# Altium schematic sheet 0251_GPU VREG_ SVID.SchDoc
size 848 x 558 mm
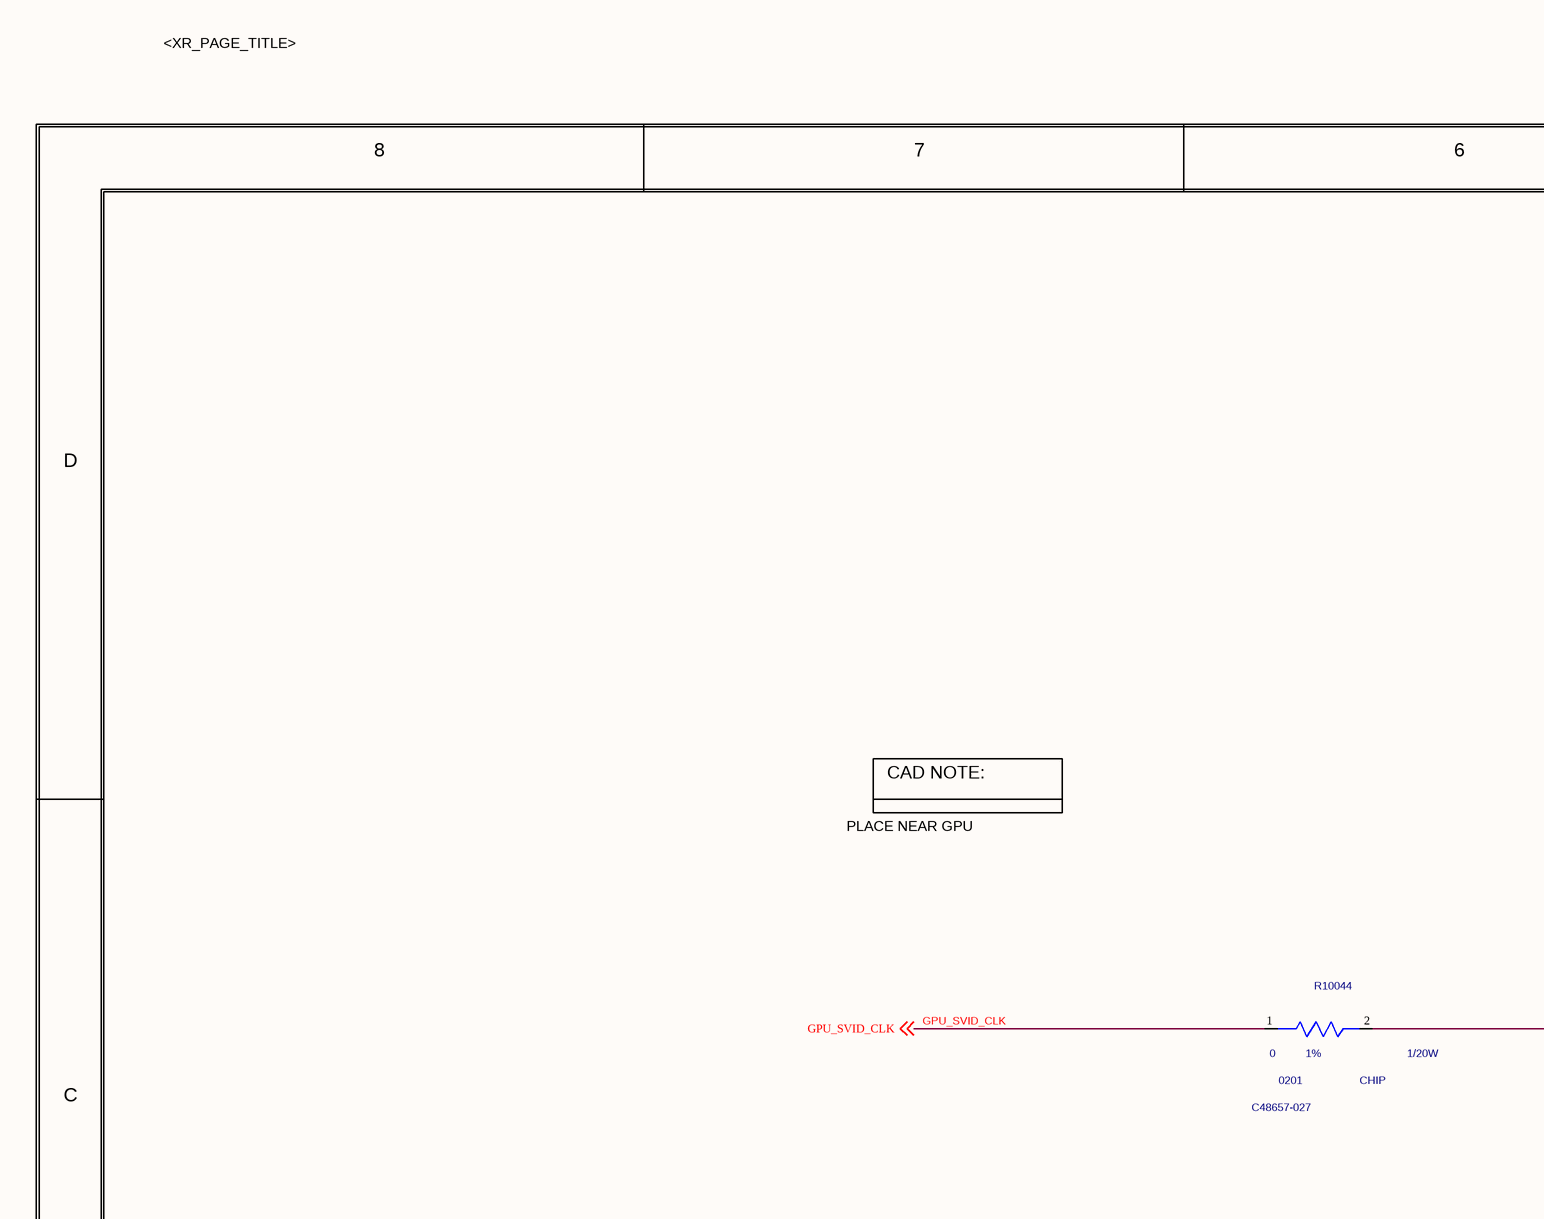
[diagram p0: 0251_GPU VREG_ SVID.SchDoc, top left]
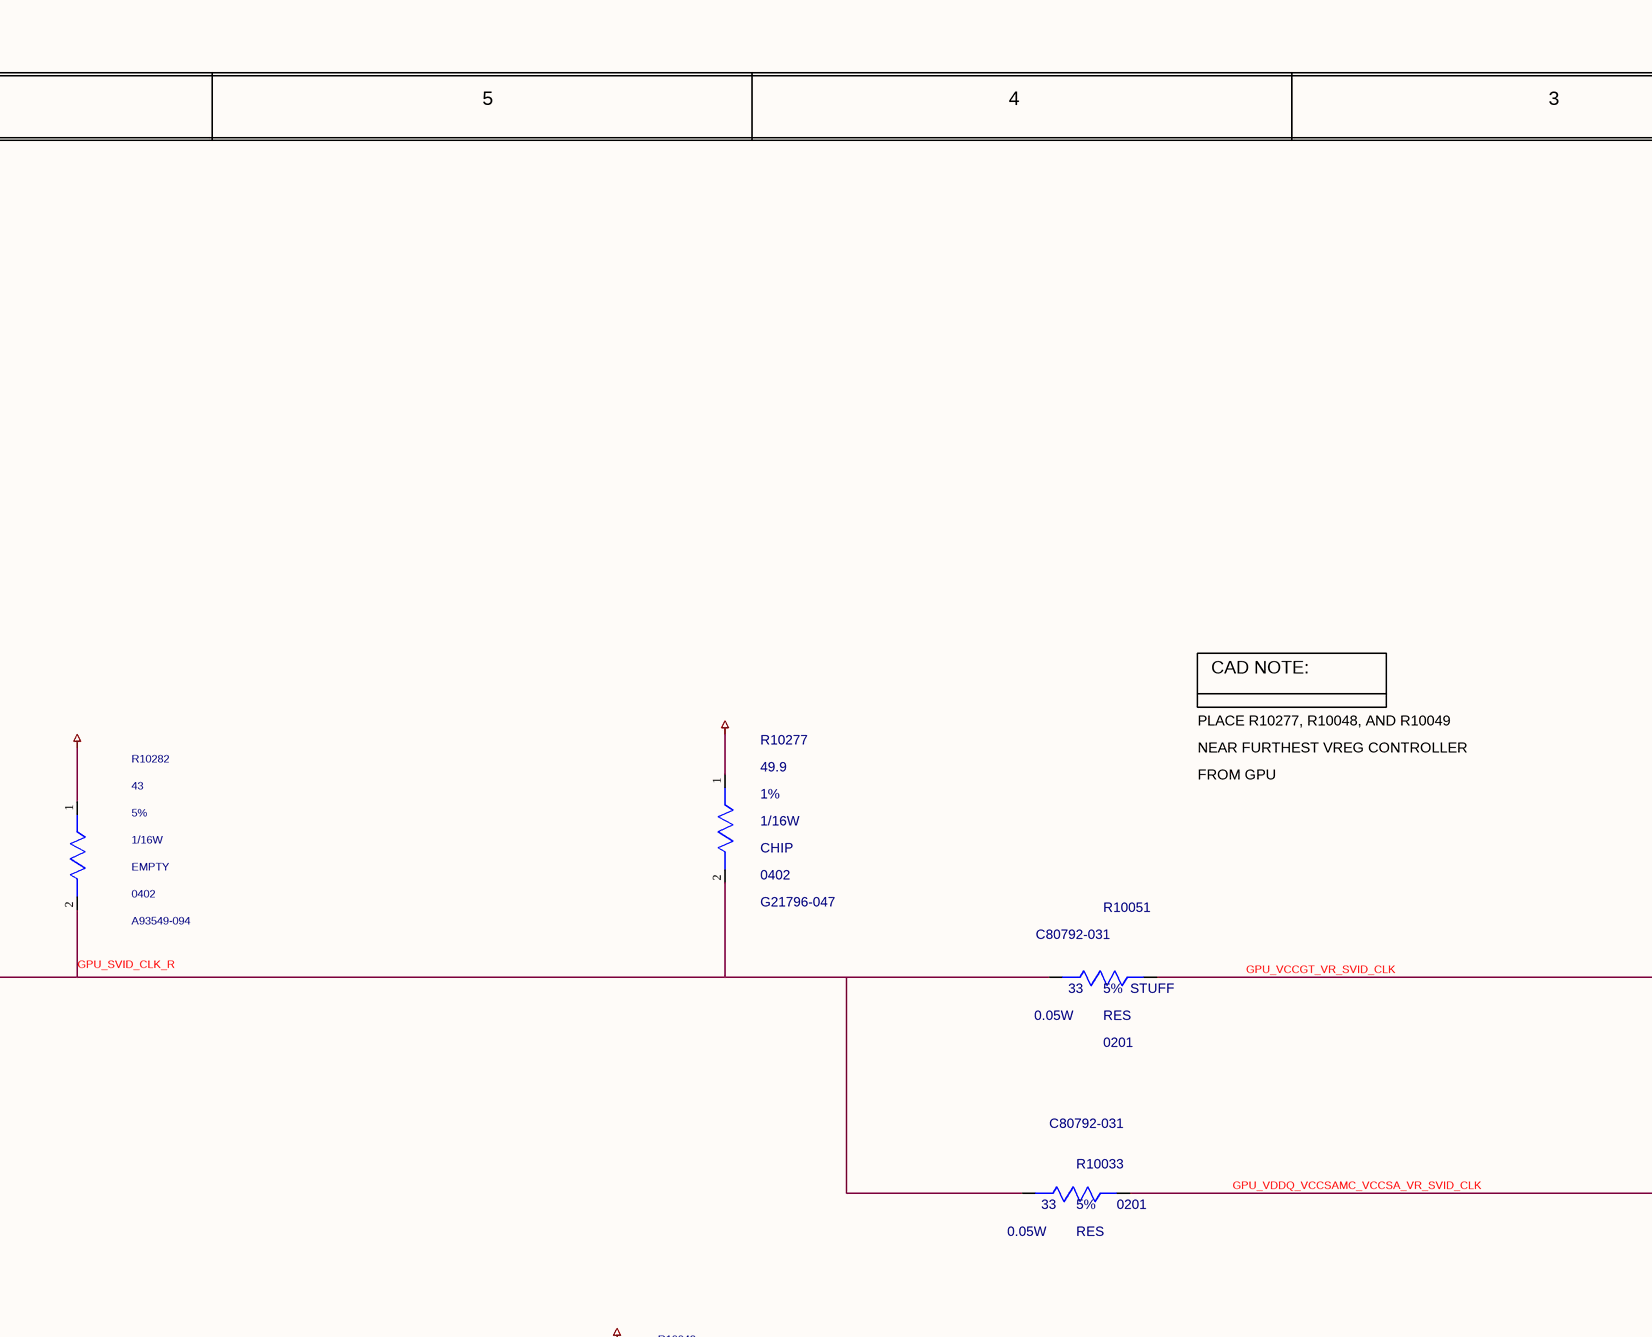
[diagram p1: 0251_GPU VREG_ SVID.SchDoc, top middle]
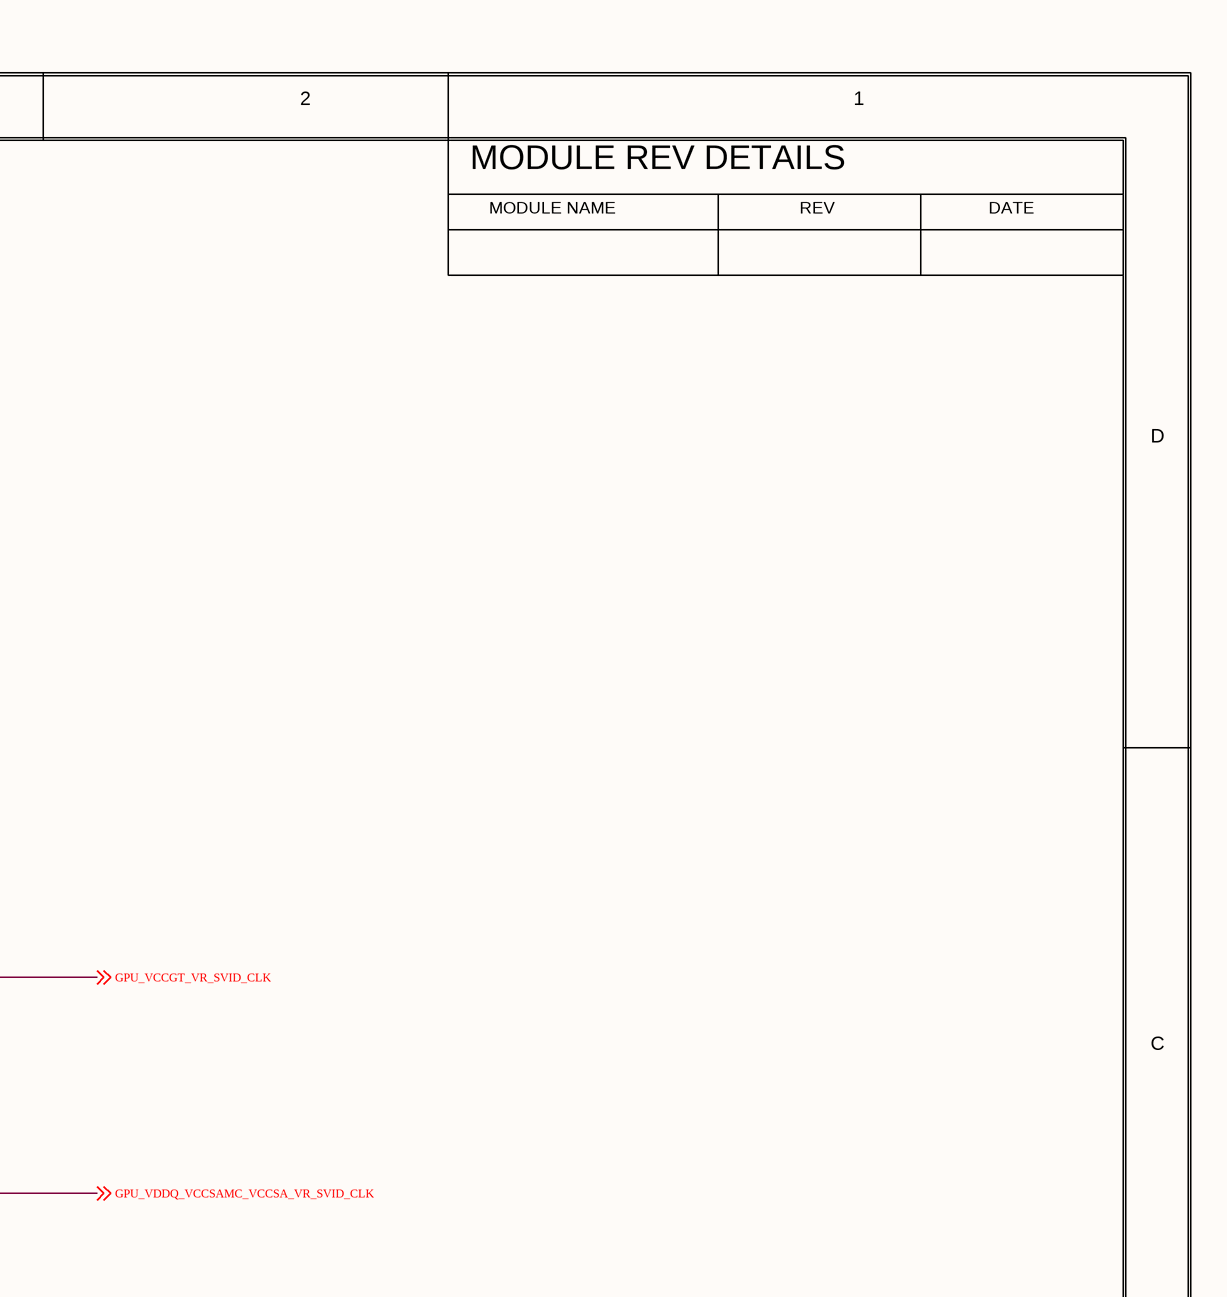
[diagram p2: 0251_GPU VREG_ SVID.SchDoc, top right]
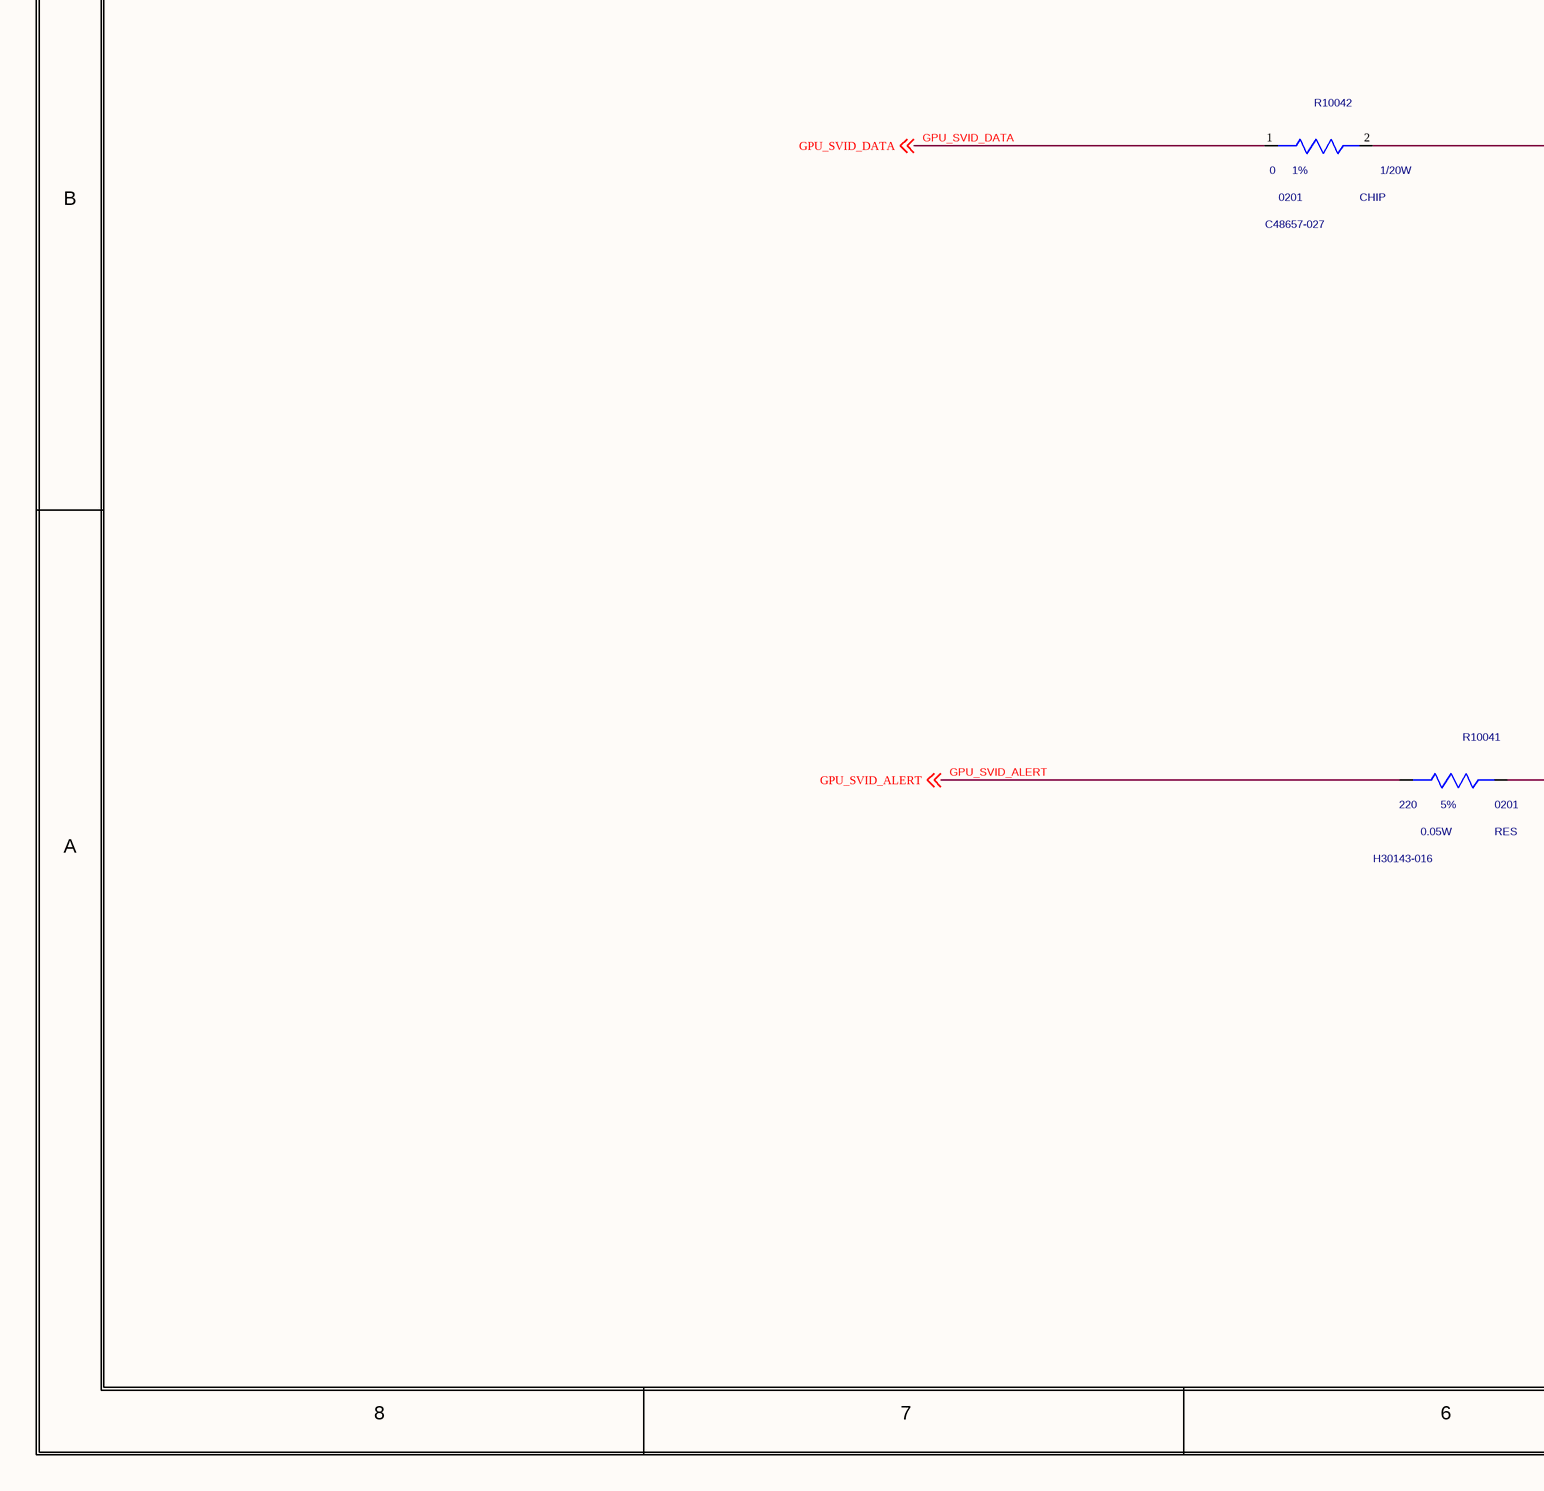
[diagram p3: 0251_GPU VREG_ SVID.SchDoc, bottom left]
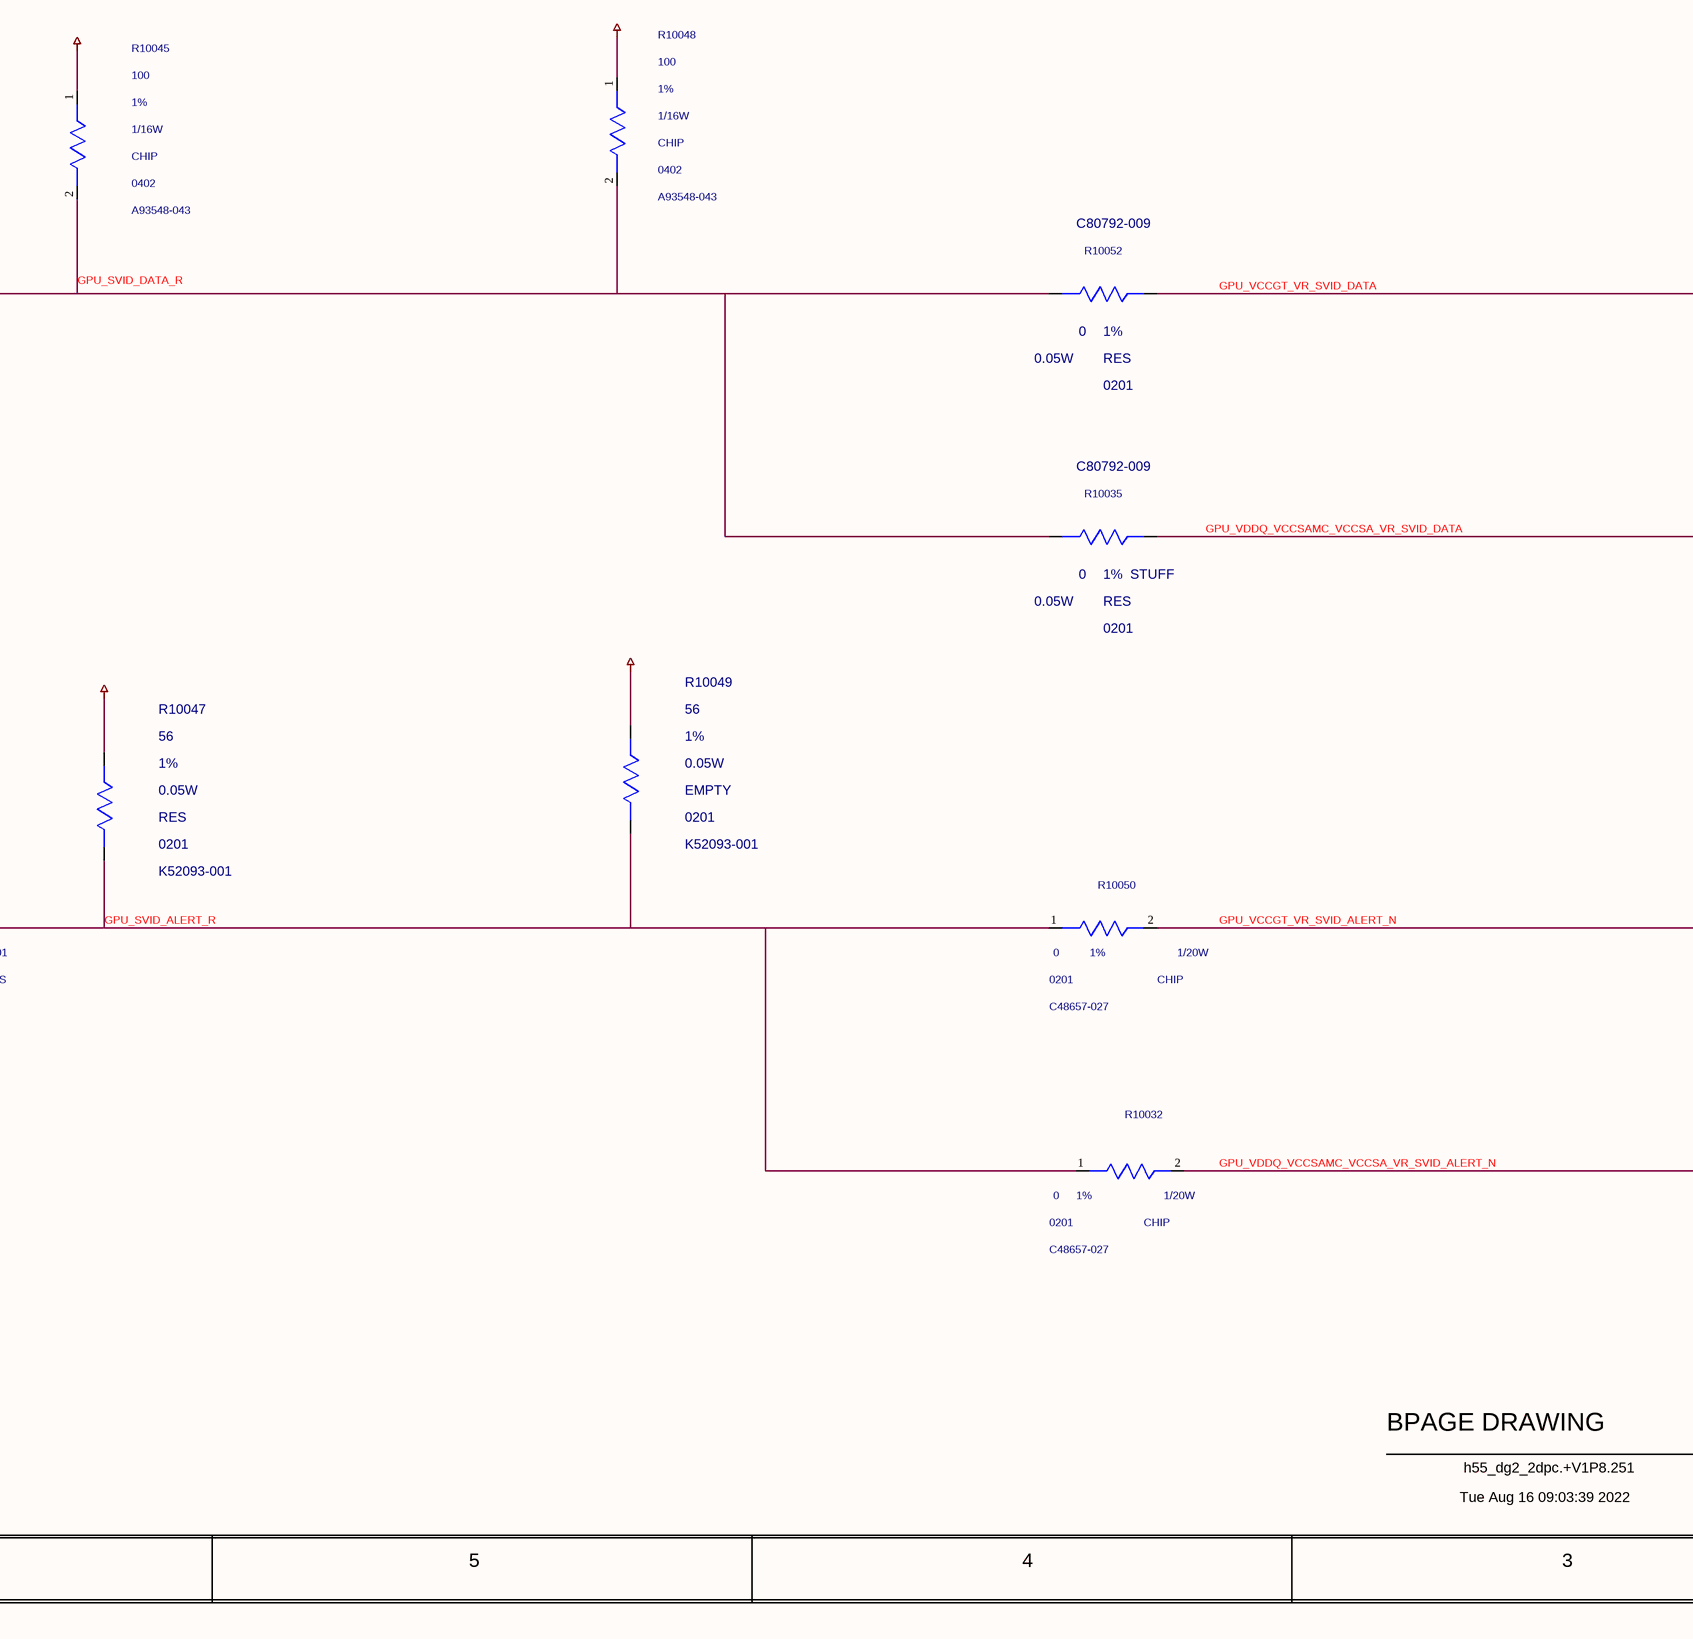
[diagram p4: 0251_GPU VREG_ SVID.SchDoc, bottom middle]
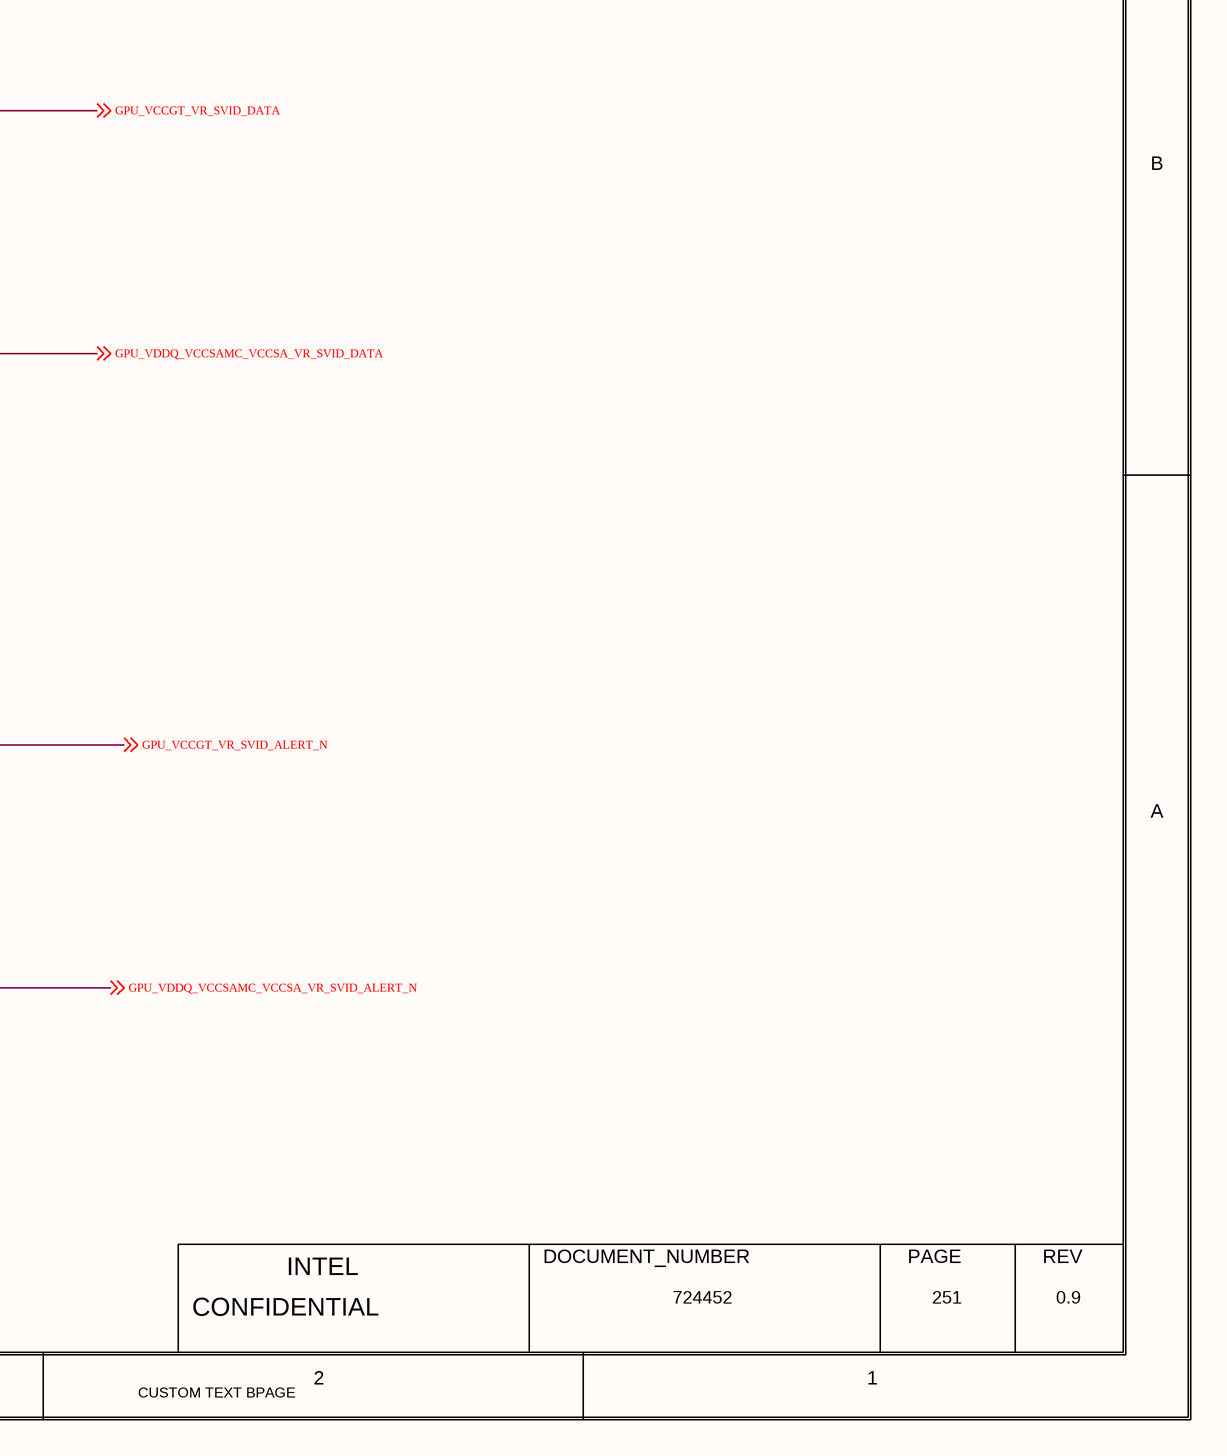
[diagram p5: 0251_GPU VREG_ SVID.SchDoc, bottom right]

## Parts
R10032  0  MATERIAL: CHIP  PACK_TYPE: 0201  PART_NUMBER: C48657-027  TOLERANCE: 1%  WATTAGE: 1/20W  [SMR0201IA]
R10033  33  MATERIAL: RES  PACK_TYPE: 0201  PART_NUMBER: C80792-031  TOLERANCE: 5%  WATTAGE: 0.05W  [TK0_SM0201_630X330_MC]
R10035  0  BOM_USE: STUFF  MATERIAL: RES  PACK_TYPE: 0201  PART_NUMBER: C80792-009  TOLERANCE: 1%  WATTAGE: 0.05W  [TK0_SM0201_630X330_MC]
R10041  220  MATERIAL: RES  PACK_TYPE: 0201  PART_NUMBER: H30143-016  TOLERANCE: 5%  WATTAGE: 0.05W  [CTK0_SM0201_630X330_MA]
R10042  0  MATERIAL: CHIP  PACK_TYPE: 0201  PART_NUMBER: C48657-027  TOLERANCE: 1%  WATTAGE: 1/20W  [SMR0201IA]
R10044  0  MATERIAL: CHIP  PACK_TYPE: 0201  PART_NUMBER: C48657-027  TOLERANCE: 1%  WATTAGE: 1/20W  [SMR0201IA]
R10045  100  MATERIAL: CHIP  PACK_TYPE: 0402  PART_NUMBER: A93548-043  TOLERANCE: 1%  WATTAGE: 1/16W  [SMR0402IA]
R10047  56  MATERIAL: RES  PACK_TYPE: 0201  PART_NUMBER: K52093-001  TOLERANCE: 1%  WATTAGE: 0.05W  [TK0_SM0201_650X350_MB]
R10048  100  MATERIAL: CHIP  PACK_TYPE: 0402  PART_NUMBER: A93548-043  TOLERANCE: 1%  WATTAGE: 1/16W  [SMR0402IA]
R10049  56  MATERIAL: EMPTY  PACK_TYPE: 0201  PART_NUMBER: K52093-001  TOLERANCE: 1%  WATTAGE: 0.05W  [TK0_SM0201_650X350_MB]
R10050  0  MATERIAL: CHIP  PACK_TYPE: 0201  PART_NUMBER: C48657-027  TOLERANCE: 1%  WATTAGE: 1/20W  [SMR0201IA]
R10051  33  BOM_USE: STUFF  MATERIAL: RES  PACK_TYPE: 0201  PART_NUMBER: C80792-031  TOLERANCE: 5%  WATTAGE: 0.05W  [TK0_SM0201_630X330_MC]
R10052  0  MATERIAL: RES  PACK_TYPE: 0201  PART_NUMBER: C80792-009  TOLERANCE: 1%  WATTAGE: 0.05W  [TK0_SM0201_630X330_MC]
R10277  49.9  MATERIAL: CHIP  PACK_TYPE: 0402  PART_NUMBER: G21796-047  TOLERANCE: 1%  WATTAGE: 1/16W  [SMR0402IA]
R10282  43  MATERIAL: EMPTY  PACK_TYPE: 0402  PART_NUMBER: A93549-094  TOLERANCE: 5%  WATTAGE: 1/16W  [SMR0402IA]

## Nets
+V1P8S_GPU: R10045.1(A) R10047.1(A) R10048.1(A) R10049.1(A) R10277.1(A) R10282.1(A)
GPU_SVID_ALERT: R10041.1(A) ; off-sheet GPU_SVID_ALERT
GPU_SVID_ALERT_R: R10032.1(A) R10041.2(B) R10047.2(B) R10049.2(B) R10050.1(A)
GPU_SVID_CLK: R10044.1(A) ; off-sheet GPU_SVID_CLK
GPU_SVID_CLK_R: R10033.1(A) R10044.2(B) R10051.1(A) R10277.2(B) R10282.2(B)
GPU_SVID_DATA: R10042.1(A) ; off-sheet GPU_SVID_DATA
GPU_SVID_DATA_R: R10035.1(A) R10042.2(B) R10045.2(B) R10048.2(B) R10052.1(A)
GPU_VCCGT_VR_SVID_ALERT_N: R10050.2(B) ; off-sheet GPU_VCCGT_VR_SVID_ALERT_N
GPU_VCCGT_VR_SVID_CLK: R10051.2(B) ; off-sheet GPU_VCCGT_VR_SVID_CLK
GPU_VCCGT_VR_SVID_DATA: R10052.2(B) ; off-sheet GPU_VCCGT_VR_SVID_DATA
GPU_VDDQ_VCCSAMC_VCCSA_VR_SVID_ALERT_N: R10032.2(B) ; off-sheet GPU_VDDQ_VCCSAMC_VCCSA_VR_SVID_ALERT_N
GPU_VDDQ_VCCSAMC_VCCSA_VR_SVID_CLK: R10033.2(B) ; off-sheet GPU_VDDQ_VCCSAMC_VCCSA_VR_SVID_CLK
GPU_VDDQ_VCCSAMC_VCCSA_VR_SVID_DATA: R10035.2(B) ; off-sheet GPU_VDDQ_VCCSAMC_VCCSA_VR_SVID_DATA

## Notes on the sheet
- <XR_PAGE_TITLE>
- 8
- 7
- 6
- 5
- 4
- 3
- 2
- 1
- MODULE REV DETAILS
- MODULE NAME
- REV
- DATE
- D
- CAD NOTE:
- PLACE R10277, R10048, AND R10049
- PLACE NEAR GPU
- NEAR FURTHEST VREG CONTROLLER
- FROM GPU
- C
- B
- A
- BPAGE DRAWING
- INTEL
- DOCUMENT_NUMBER
- PAGE
- Tue Aug 16 09:03:39 2022
- h55_dg2_2dpc.+V1P8.251
- CONFIDENTIAL
- 724452
- 251
- 0.9
- CUSTOM TEXT BPAGE

## Library data of the parts
R10032 = RES#1: CHIPS_PART_NAME: RES; CDS_PHYS_PART_NAME: RES_0201-C48657-027,CHIP,0,1%,1/20W,LPDB,GENERIC; OriginalSymbolOrigin: (-75,25); XY: (-3400,1225); VER: 1; PHYS_PAGE: 251; LOCATION: R10032; DRAWING: @RVP1_ADL_SB_ADP_S_DDR5_SODIMM_2DPC_LIB.H55_DG2_2DPC(SCH_1):PAGE363; CDS_LIB: discrete; PCB Footprint: SMR0201IA; ROT: 0; CDS_PART_NAME: RES_0201-C48657-027,CHIP,0,1%,1/20W,LPDB,GENERIC; CDS_LOCATION: R10032
R10033 = RES_2#1: CHIPS_PART_NAME: RES_2; CDS_PHYS_PART_NAME: RES_2_0201-C80792-031,RES,33,5%,0.05W,TK0,GENERIC; BOM_USE: STUFF; CDS_LMAN_SYM_OUTLINE: -50,50,50,-50; FP_TECH: TK0; IP: GENERIC; ROOM: NONE; OriginalSymbolOrigin: (-75,25); XY: (-3500,3600); VER: 1; ROT: 0; PHYS_PAGE: 251; LOCATION: R10033; DRAWING: @RVP1_ADL_SB_ADP_S_DDR5_SODIMM_2DPC_LIB.H55_DG2_2DPC(SCH_1):PAGE363; CDS_LIB: discrete_2; VARIANT: ?; PCB Footprint: TK0_SM0201_630X330_MC; CDS_PART_NAME: RES_2_0201-C80792-031,RES,33,5%,0.05W,TK0,GENERIC; CDS_LOCATION: R10033
R10035 = RES_2#1: CHIPS_PART_NAME: RES_2; CDS_PHYS_PART_NAME: RES_2_0201-C80792-009,RES,0,1%,0.05W,TK0,GENERIC; CDS_LMAN_SYM_OUTLINE: -50,50,50,-50; FP_TECH: TK0; IP: GENERIC; ROOM: NONE; OriginalSymbolOrigin: (-75,25); XY: (-3450,2400); VER: 1; PHYS_PAGE: 251; LOCATION: R10035; DRAWING: @RVP1_ADL_SB_ADP_S_DDR5_SODIMM_2DPC_LIB.H55_DG2_2DPC(SCH_1):PAGE363; CDS_LIB: discrete_2; VARIANT: ?; PCB Footprint: TK0_SM0201_630X330_MC; ROT: 0; CDS_PART_NAME: RES_2_0201-C80792-009,RES,0,1%,0.05W,TK0,GENERIC; CDS_LOCATION: R10035
R10041 = C_RES#1: CHIPS_PART_NAME: C_RES; CDS_PHYS_PART_NAME: C_RES_0201-H30143-016,RES,220,5%,0.05W,TK0,GENERIC; CDS_LMAN_SYM_OUTLINE: -50,50,50,-50; FP_TECH: TK0; IP: GENERIC; ROOM: NONE; OriginalSymbolOrigin: (-75,25); XY: (-5600,1675); VER: 1; ROT: 0; PHYS_PAGE: 251; LOCATION: R10041; DRAWING: @RVP1_ADL_SB_ADP_S_DDR5_SODIMM_2DPC_LIB.H55_DG2_2DPC(SCH_1):PAGE363; CDS_LIB: c_discrete; VARIANT: ?; PCB Footprint: CTK0_SM0201_630X330_MA; CDS_PART_NAME: C_RES_0201-H30143-016,RES,220,5%,0.05W,TK0,GENERIC; CDS_LOCATION: R10041
R10042 = RES#1: CHIPS_PART_NAME: RES; CDS_PHYS_PART_NAME: RES_0201-C48657-027,CHIP,0,1%,1/20W,LPDB,GENERIC; OriginalSymbolOrigin: (-75,25); XY: (-5850,2850); VER: 1; PHYS_PAGE: 251; LOCATION: R10042; DRAWING: @RVP1_ADL_SB_ADP_S_DDR5_SODIMM_2DPC_LIB.H55_DG2_2DPC(SCH_1):PAGE363; CDS_LIB: discrete; PCB Footprint: SMR0201IA; ROT: 0; CDS_PART_NAME: RES_0201-C48657-027,CHIP,0,1%,1/20W,LPDB,GENERIC; CDS_LOCATION: R10042
R10044 = RES#1: CHIPS_PART_NAME: RES; CDS_PHYS_PART_NAME: RES_0201-C48657-027,CHIP,0,1%,1/20W,LPDB,GENERIC; OriginalSymbolOrigin: (-75,25); XY: (-5850,4000); VER: 1; PHYS_PAGE: 251; LOCATION: R10044; DRAWING: @RVP1_ADL_SB_ADP_S_DDR5_SODIMM_2DPC_LIB.H55_DG2_2DPC(SCH_1):PAGE363; CDS_LIB: discrete; PCB Footprint: SMR0201IA; ROT: 0; CDS_PART_NAME: RES_0201-C48657-027,CHIP,0,1%,1/20W,LPDB,GENERIC; CDS_LOCATION: R10044
R10045 = RES: CDS_PHYS_PART_NAME: RES_0402-A93548-043,CHIP,100,1%,1/16W,LPDB,GENERIC; OriginalSymbolOrigin: (-25,75); XY: (-5350,3125); VER: 2; ROT: 0; PHYS_PAGE: 251; LOCATION: R10045; FP_TECH: LPDB; DRAWING: @RVP1_ADL_SB_ADP_S_DDR5_SODIMM_2DPC_LIB.H55_DG2_2DPC(SCH_1):PAGE363; CDS_LIB: discrete; PCB Footprint: SMR0402IA; CHIPS_PART_NAME: RES; CDS_PART_NAME: RES_0402-A93548-043,CHIP,100,1%,1/16W,LPDB,GENERIC; CDS_LOCATION: R10045
R10047 = RES_2: CDS_PHYS_PART_NAME: RES_2_0201-K52093-001,RES,56,1%,0.05W,TK0,GENERIC; BOM_USE: STUFF; CDS_LMAN_SYM_OUTLINE: -50,50,50,-50; FP_TECH: TK0; IP: GENERIC; ROOM: NONE; OriginalSymbolOrigin: (-25,75); XY: (-5300,1900); VER: 2; ROT: 0; PHYS_PAGE: 251; LOCATION: R10047; DRAWING: @RVP1_ADL_SB_ADP_S_DDR5_SODIMM_2DPC_LIB.H55_DG2_2DPC(SCH_1):PAGE363; CDS_LIB: discrete_2; VARIANT: ?; PCB Footprint: TK0_SM0201_650X350_MB; CHIPS_PART_NAME: RES_2; CDS_PART_NAME: RES_2_0201-K52093-001,RES,56,1%,0.05W,TK0,GENERIC; CDS_LOCATION: R10047
R10048 = RES: CDS_PHYS_PART_NAME: RES_0402-A93548-043,CHIP,100,1%,1/16W,LPDB,GENERIC; OriginalSymbolOrigin: (-25,75); XY: (-4350,3150); VER: 2; ROT: 0; PHYS_PAGE: 251; LOCATION: R10048; FP_TECH: LPDB; DRAWING: @RVP1_ADL_SB_ADP_S_DDR5_SODIMM_2DPC_LIB.H55_DG2_2DPC(SCH_1):PAGE363; CDS_LIB: discrete; PCB Footprint: SMR0402IA; CHIPS_PART_NAME: RES; CDS_PART_NAME: RES_0402-A93548-043,CHIP,100,1%,1/16W,LPDB,GENERIC; CDS_LOCATION: R10048
R10049 = RES_2: CDS_PHYS_PART_NAME: RES_2_0201-K52093-001,EMPTY,56,1%,0.05W,TK0,GENERIC; BOM_USE: STUFF; CDS_LMAN_SYM_OUTLINE: -50,50,50,-50; FP_TECH: TK0; IP: GENERIC; ROOM: NONE; OriginalSymbolOrigin: (-25,75); XY: (-4325,1950); VER: 2; ROT: 0; PHYS_PAGE: 251; LOCATION: R10049; DRAWING: @RVP1_ADL_SB_ADP_S_DDR5_SODIMM_2DPC_LIB.H55_DG2_2DPC(SCH_1):PAGE363; CDS_LIB: discrete_2; VARIANT: ?; PCB Footprint: TK0_SM0201_650X350_MB; CHIPS_PART_NAME: RES_2; CDS_PART_NAME: RES_2_0201-K52093-001,EMPTY,56,1%,0.05W,TK0,GENERIC; CDS_LOCATION: R10049
R10050 = RES#1: CHIPS_PART_NAME: RES; CDS_PHYS_PART_NAME: RES_0201-C48657-027,CHIP,0,1%,1/20W,LPDB,GENERIC; OriginalSymbolOrigin: (-75,25); XY: (-3450,1675); VER: 1; PHYS_PAGE: 251; LOCATION: R10050; DRAWING: @RVP1_ADL_SB_ADP_S_DDR5_SODIMM_2DPC_LIB.H55_DG2_2DPC(SCH_1):PAGE363; CDS_LIB: discrete; PCB Footprint: SMR0201IA; ROT: 0; CDS_PART_NAME: RES_0201-C48657-027,CHIP,0,1%,1/20W,LPDB,GENERIC; CDS_LOCATION: R10050
R10051 = RES_2#1: CHIPS_PART_NAME: RES_2; CDS_PHYS_PART_NAME: RES_2_0201-C80792-031,RES,33,5%,0.05W,TK0,GENERIC; CDS_LMAN_SYM_OUTLINE: -50,50,50,-50; FP_TECH: TK0; IP: GENERIC; ROOM: NONE; OriginalSymbolOrigin: (-75,25); XY: (-3450,4000); VER: 1; ROT: 0; PHYS_PAGE: 251; LOCATION: R10051; DRAWING: @RVP1_ADL_SB_ADP_S_DDR5_SODIMM_2DPC_LIB.H55_DG2_2DPC(SCH_1):PAGE363; CDS_LIB: discrete_2; VARIANT: ?; PCB Footprint: TK0_SM0201_630X330_MC; CDS_PART_NAME: RES_2_0201-C80792-031,RES,33,5%,0.05W,TK0,GENERIC; CDS_LOCATION: R10051
R10052 = RES_2#1: CHIPS_PART_NAME: RES_2; CDS_PHYS_PART_NAME: RES_2_0201-C80792-009,RES,0,1%,0.05W,TK0,GENERIC; BOM_USE: STUFF; CDS_LMAN_SYM_OUTLINE: -50,50,50,-50; FP_TECH: TK0; IP: GENERIC; ROOM: NONE; OriginalSymbolOrigin: (-75,25); XY: (-3450,2850); VER: 1; PHYS_PAGE: 251; LOCATION: R10052; DRAWING: @RVP1_ADL_SB_ADP_S_DDR5_SODIMM_2DPC_LIB.H55_DG2_2DPC(SCH_1):PAGE363; CDS_LIB: discrete_2; VARIANT: ?; PCB Footprint: TK0_SM0201_630X330_MC; ROT: 0; CDS_PART_NAME: RES_2_0201-C80792-009,RES,0,1%,0.05W,TK0,GENERIC; CDS_LOCATION: R10052
R10277 = RES: CDS_PHYS_PART_NAME: RES_0402-G21796-047,CHIP,49.9,1%,1/16W,LPDB,GENERIC; OriginalSymbolOrigin: (-25,75); XY: (-4150,4275); VER: 2; ROT: 0; PHYS_PAGE: 251; LOCATION: R10277; IP: GENERIC; FP_TECH: LPDB; DRAWING: @RVP1_ADL_SB_ADP_S_DDR5_SODIMM_2DPC_LIB.H55_DG2_2DPC(SCH_1):PAGE363; CDS_LIB: discrete; PCB Footprint: SMR0402IA; CHIPS_PART_NAME: RES; CDS_PART_NAME: RES_0402-G21796-047,CHIP,49.9,1%,1/16W,LPDB,GENERIC; CDS_LOCATION: R10277
R10282 = RES: CDS_PHYS_PART_NAME: RES_0402-A93549-094,EMPTY,43,5%,1/16W,LPDB,GENERIC; OriginalSymbolOrigin: (-25,75); XY: (-5350,4225); VER: 2; ROT: 0; PHYS_PAGE: 251; LOCATION: R10282; DRAWING: @RVP1_ADL_SB_ADP_S_DDR5_SODIMM_2DPC_LIB.H55_DG2_2DPC(SCH_1):PAGE363; CDS_LIB: discrete; PCB Footprint: SMR0402IA; CHIPS_PART_NAME: RES; CDS_PART_NAME: RES_0402-A93549-094,EMPTY,43,5%,1/16W,LPDB,GENERIC; CDS_LOCATION: R10282